# Altium schematic sheet RN2483.SchDoc
size A4
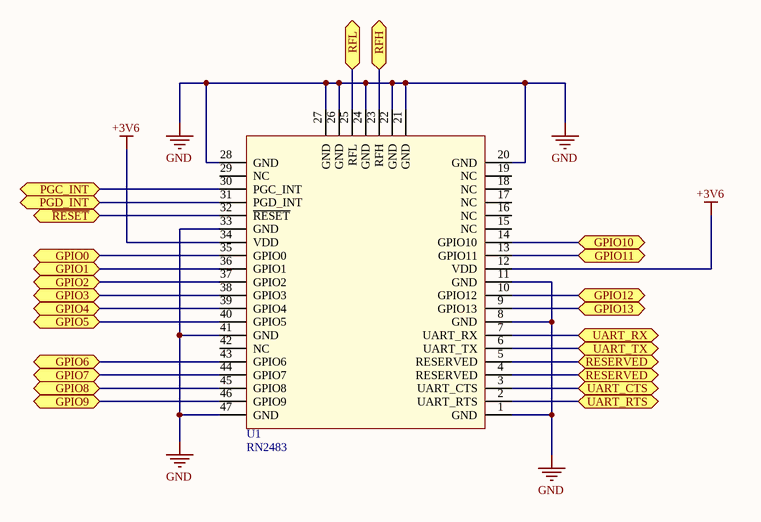
[diagram p0: RN2483.SchDoc]

## Parts
U1  RN2483  [RN2483]

## Ports
GPIO0, GPIO1, GPIO2, GPIO3, GPIO4, GPIO5, GPIO6, GPIO7, GPIO8, GPIO9, GPIO10, GPIO11, GPIO12, GPIO13, PGC_INT, PGD_INT, RESERVED, RFH, RFL, UART_CTS, UART_RTS, UART_RX, UART_TX, ~{RESET}

## Nets
+3V6: U1.12(VDD) U1.34(VDD)
GND: U1.1(GND) U1.8(GND) U1.11(GND) U1.20(GND) U1.21(GND) U1.22(GND) U1.24(GND) U1.26(GND) U1.27(GND) U1.28(GND) U1.33(GND) U1.41(GND) U1.47(GND)
GPIO0: U1.35(GPIO0) ; port GPIO0
GPIO1: U1.36(GPIO1) ; port GPIO1
GPIO2: U1.37(GPIO2) ; port GPIO2
GPIO3: U1.38(GPIO3) ; port GPIO3
GPIO4: U1.39(GPIO4) ; port GPIO4
GPIO5: U1.40(GPIO5) ; port GPIO5
GPIO6: U1.43(GPIO6) ; port GPIO6
GPIO7: U1.44(GPIO7) ; port GPIO7
GPIO8: U1.45(GPIO8) ; port GPIO8
GPIO9: U1.46(GPIO9) ; port GPIO9
GPIO10: U1.14(GPIO10) ; port GPIO10
GPIO11: U1.13(GPIO11) ; port GPIO11
GPIO12: U1.10(GPIO12) ; port GPIO12
GPIO13: U1.9(GPIO13) ; port GPIO13
PGC_INT: U1.30(PGC_INT) ; port PGC_INT
PGD_INT: U1.31(PGD_INT) ; port PGD_INT
~{RESET}: U1.32(~{RESET}) ; port ~{RESET}
RESERVED: U1.4(RESERVED) U1.5(RESERVED) ; port RESERVED
RFH: U1.23(RFH) ; port RFH
RFL: U1.25(RFL) ; port RFL
UART_CTS: U1.3(UART_CTS) ; port UART_CTS
UART_RTS: U1.2(UART_RTS) ; port UART_RTS
UART_RX: U1.7(UART_RX) ; port UART_RX
UART_TX: U1.6(UART_TX) ; port UART_TX

Not connected (* = marked no-connect by the designer): U1 15(NC) 16(NC) 17(NC) 18(NC) 19(NC) 29(NC) 42(NC)

## Library data of the parts
U1 = RN2483: Low-Power Long Range LoRa® Technology  Transceiver Module; Value: RN2483